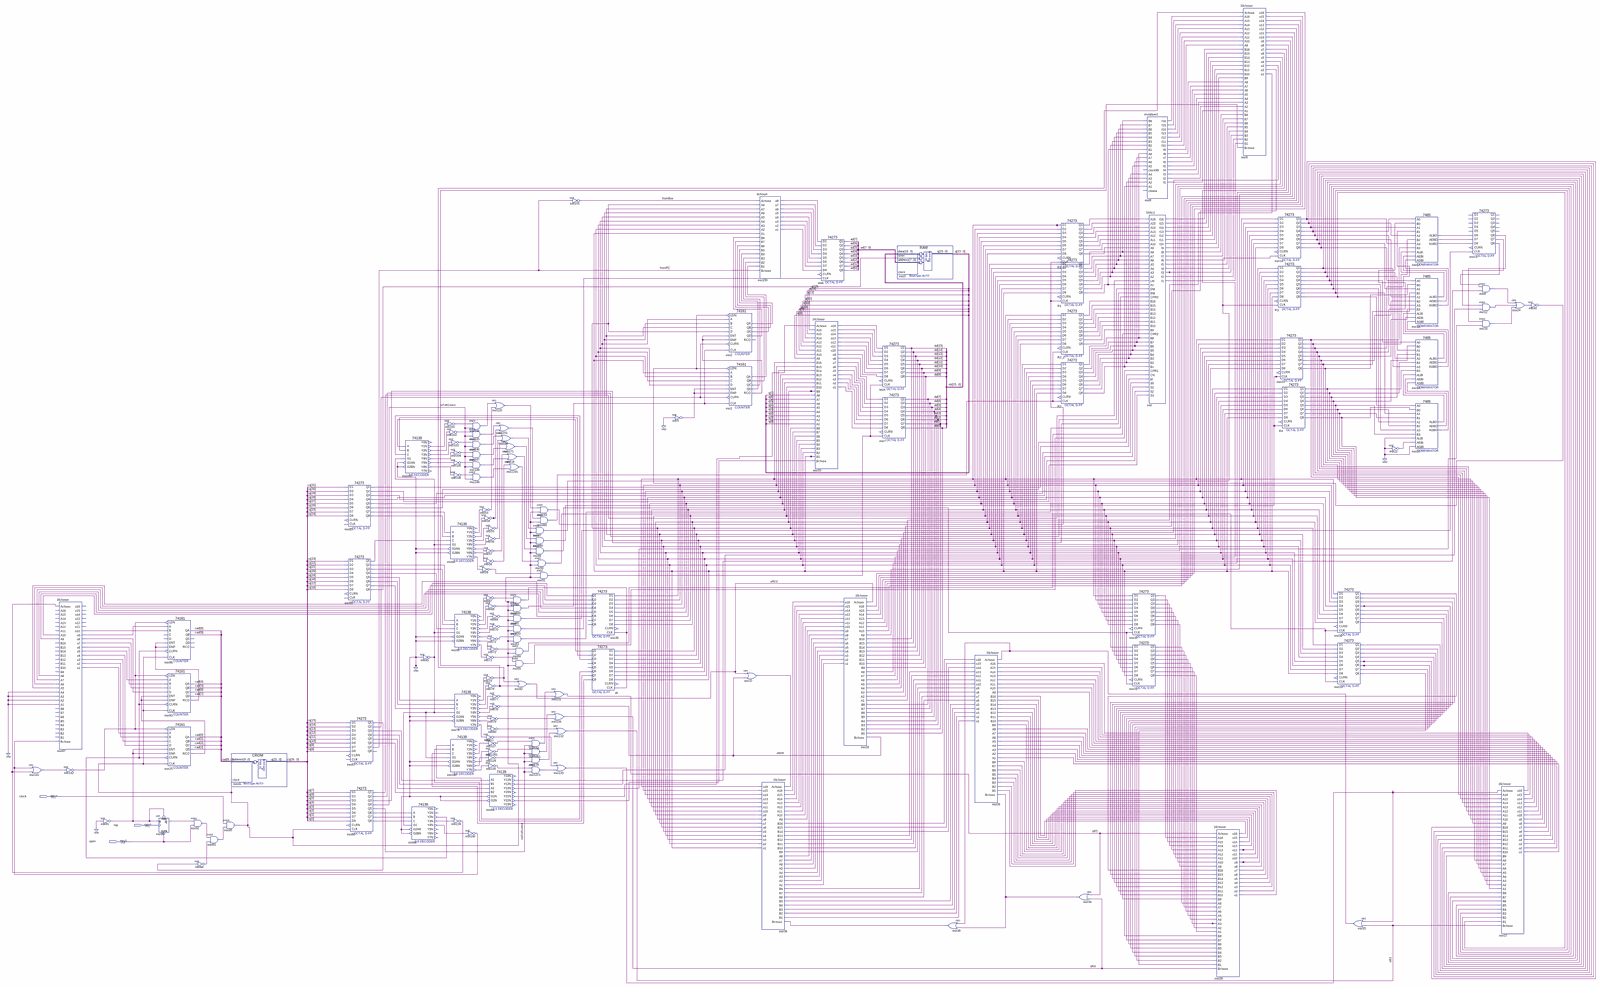
[diagram p0: schematic sheet, whole]
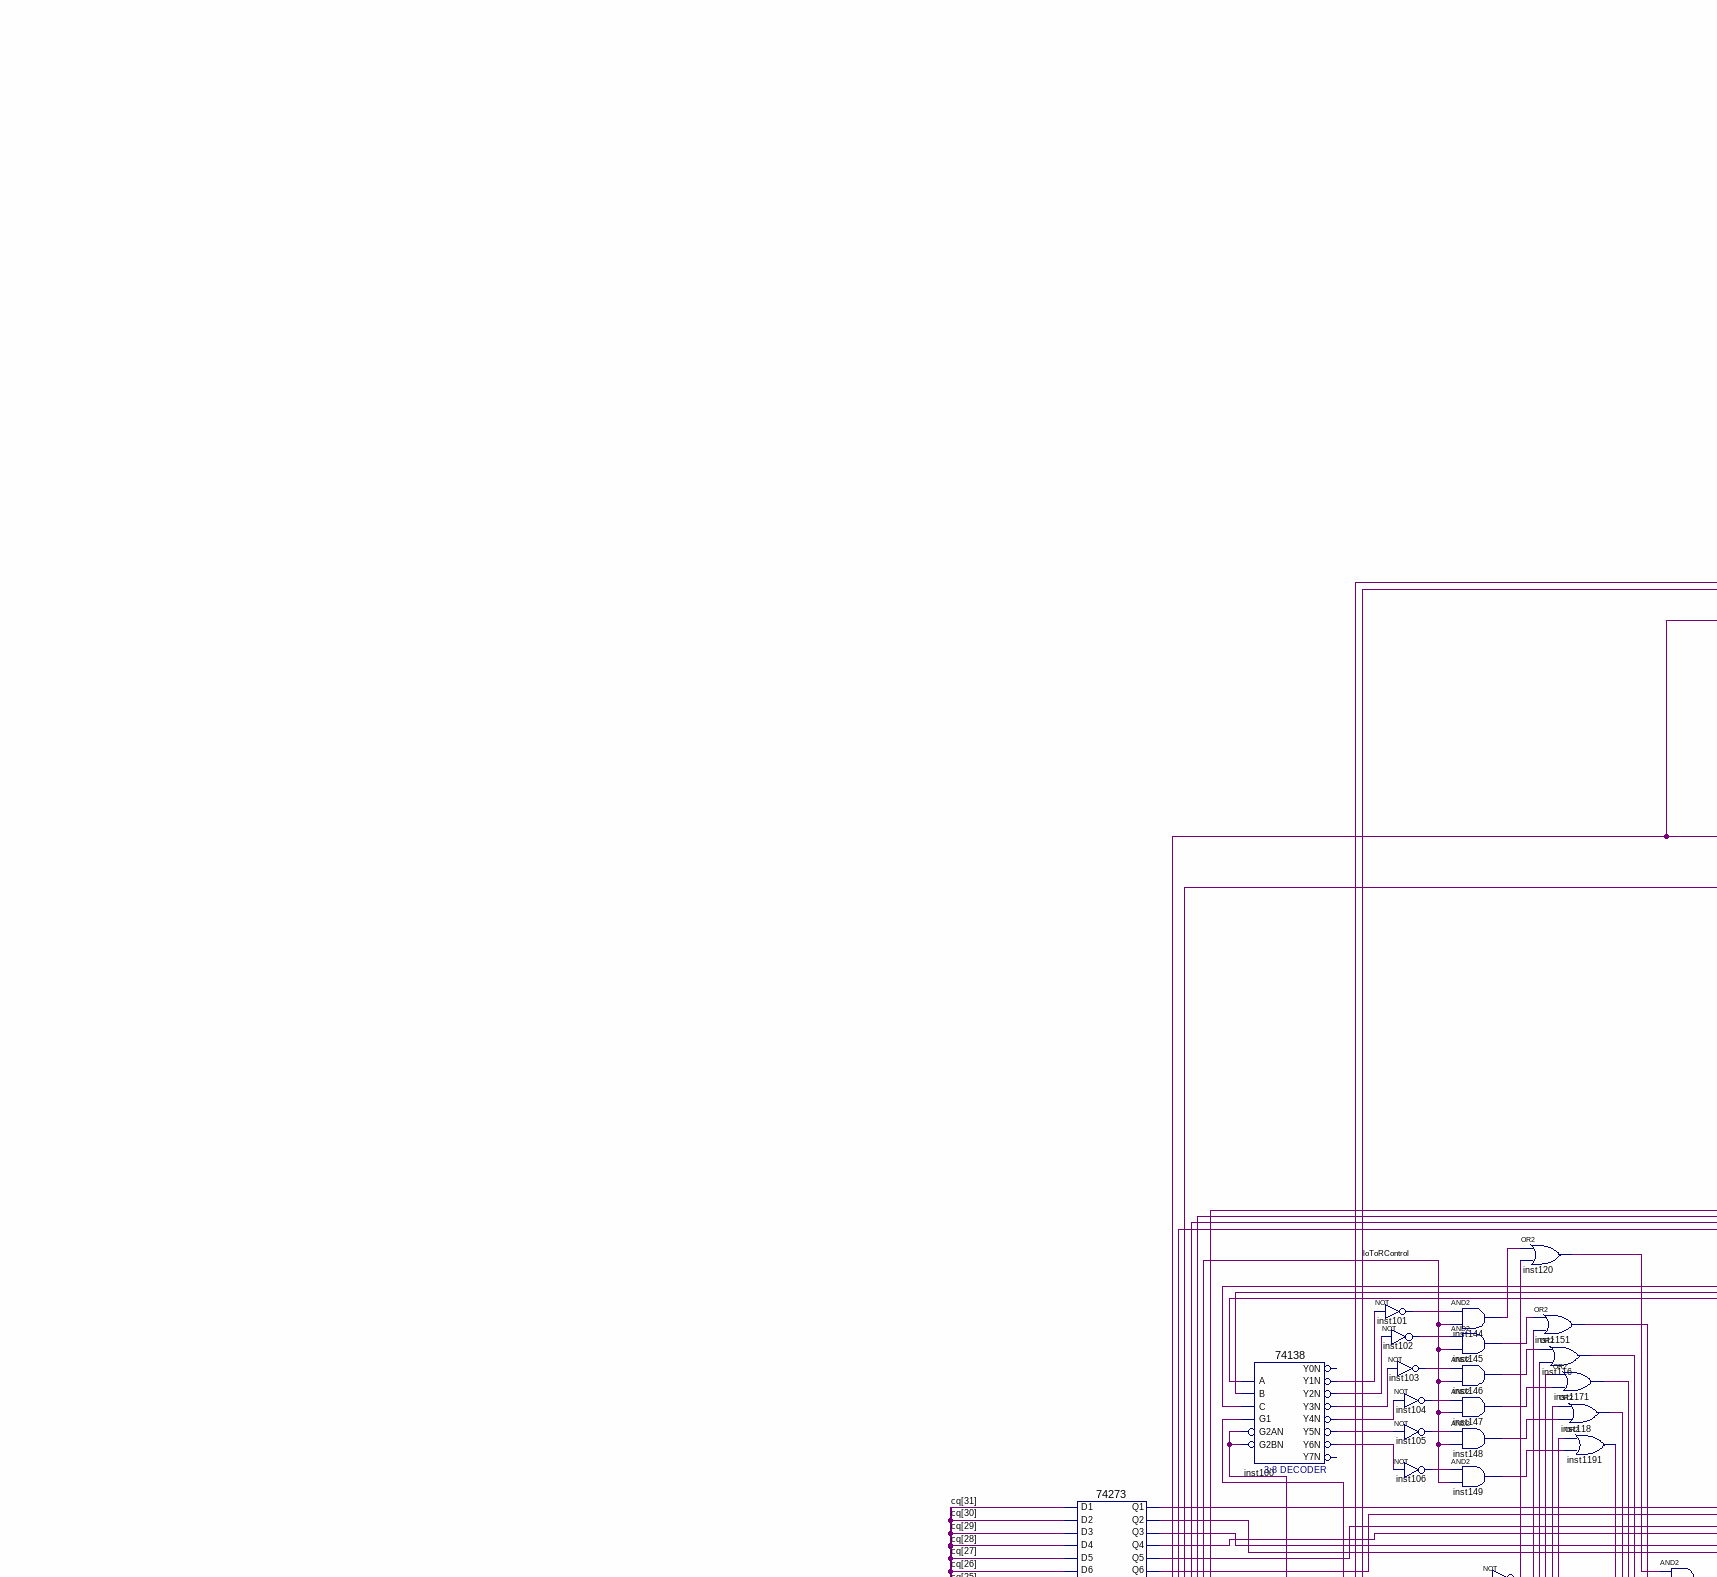
[diagram p1: schematic sheet, upper left part]
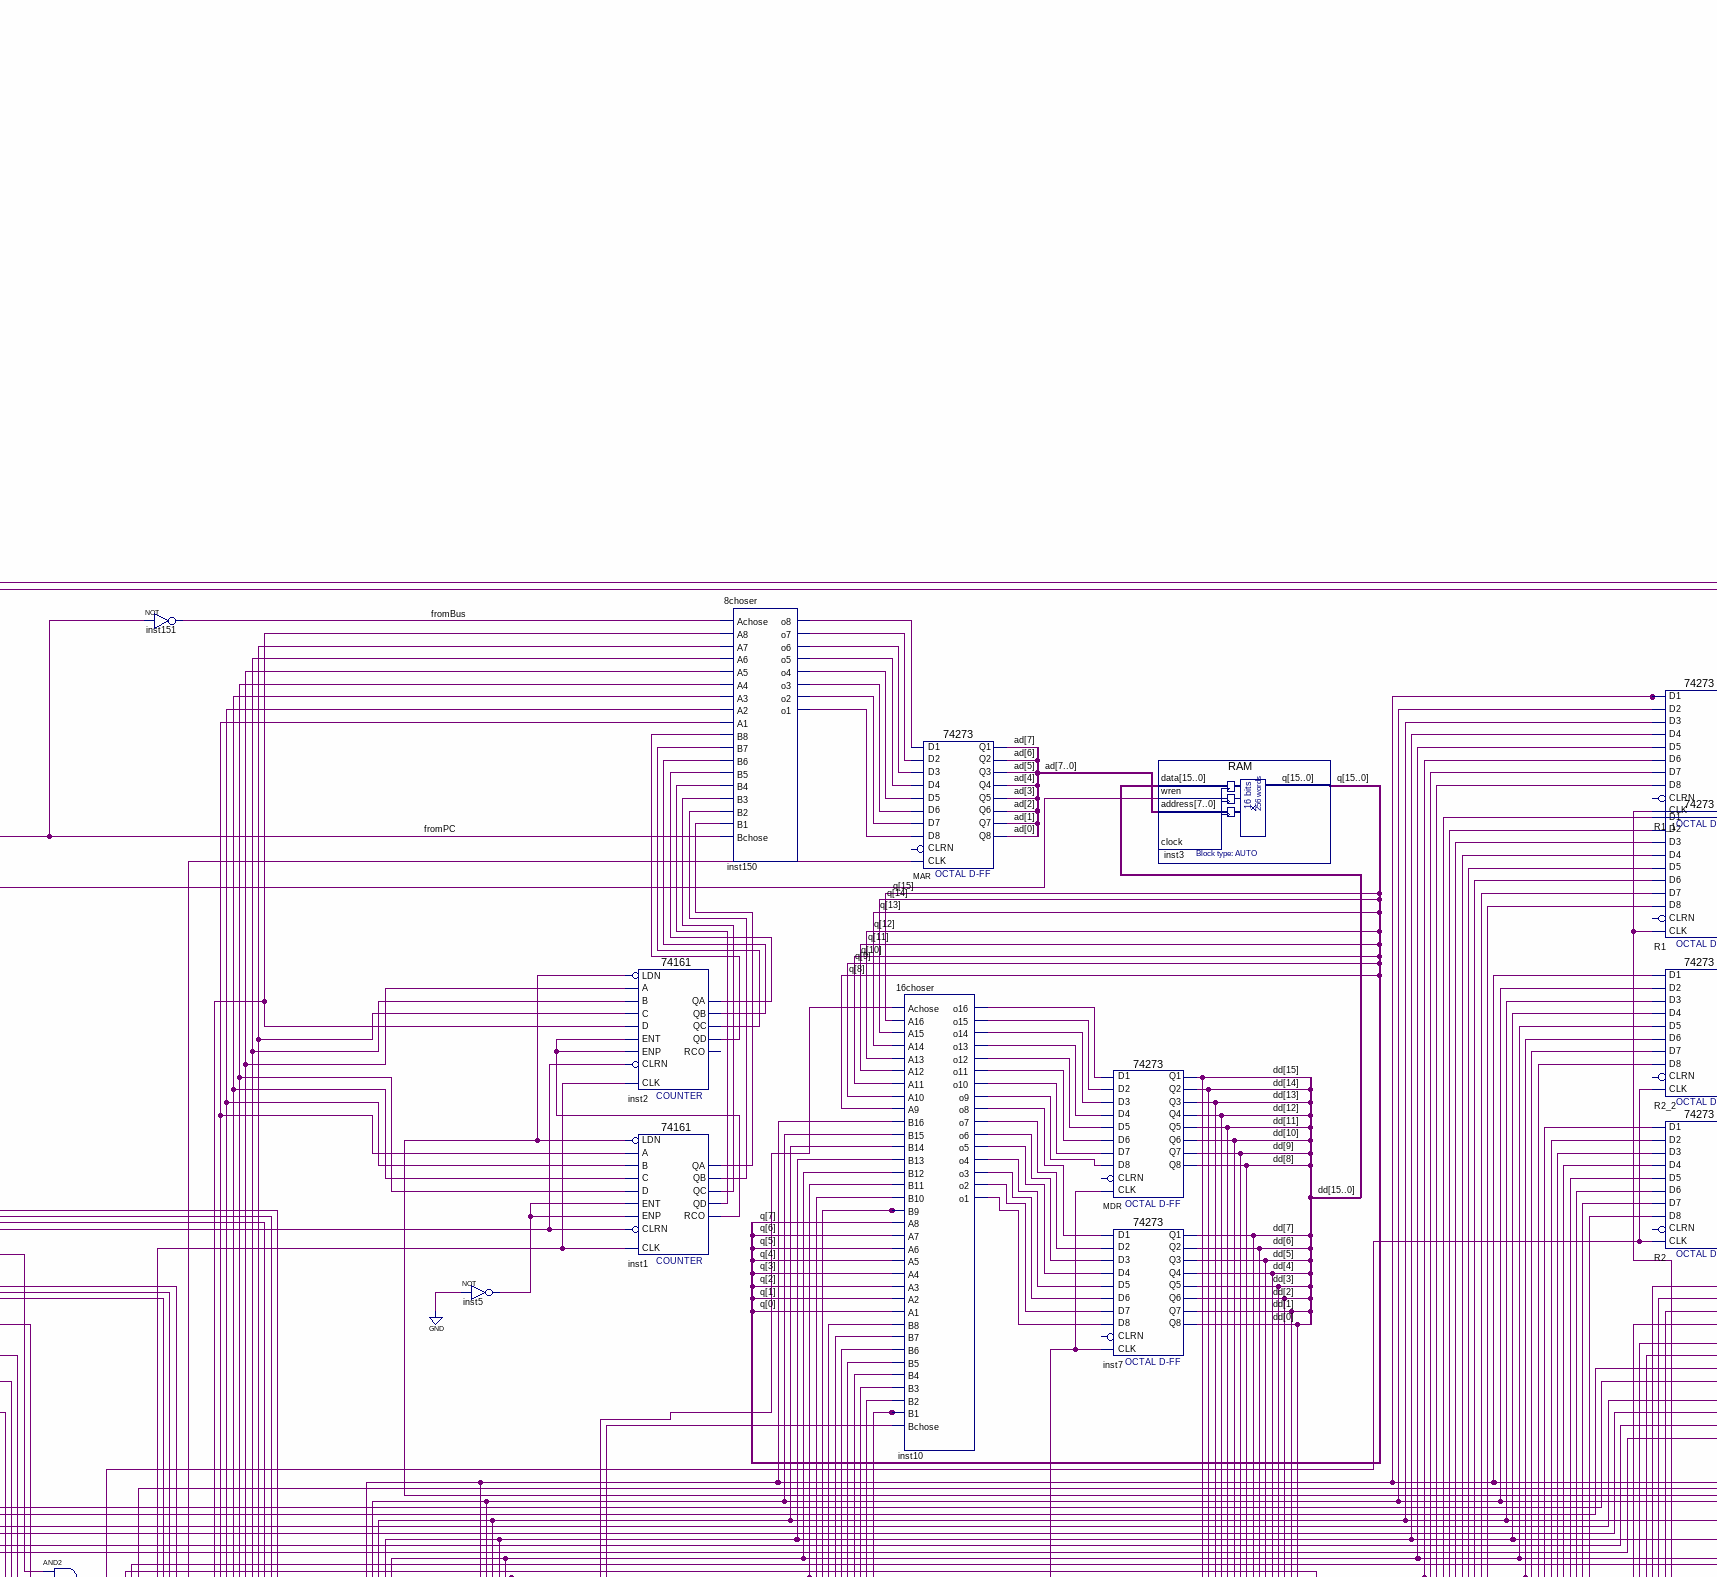
[diagram p2: schematic sheet, upper centre part]
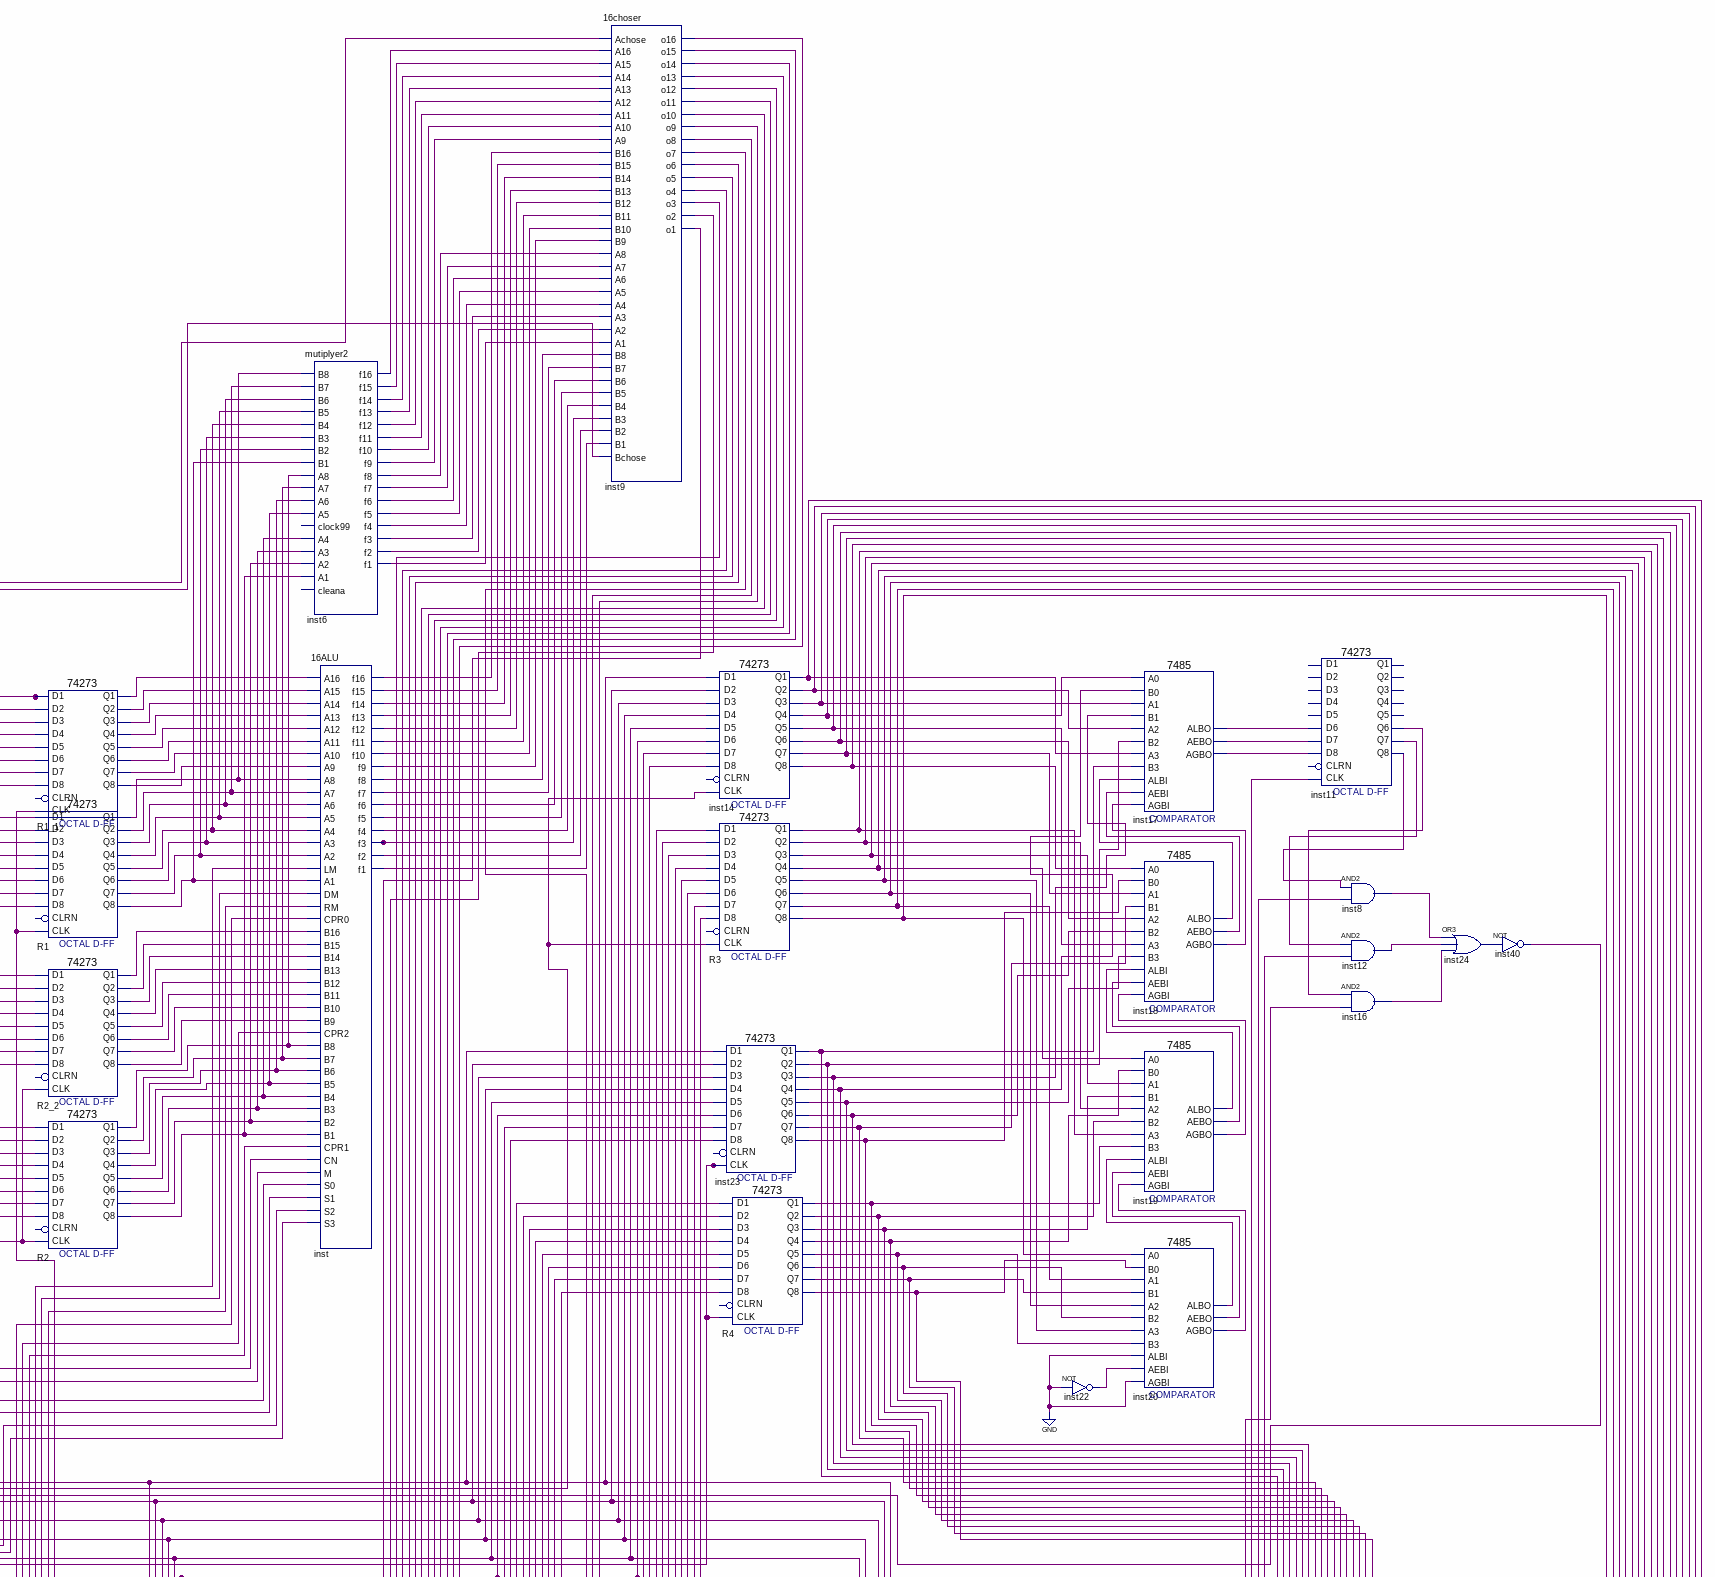
[diagram p3: schematic sheet, upper right part]
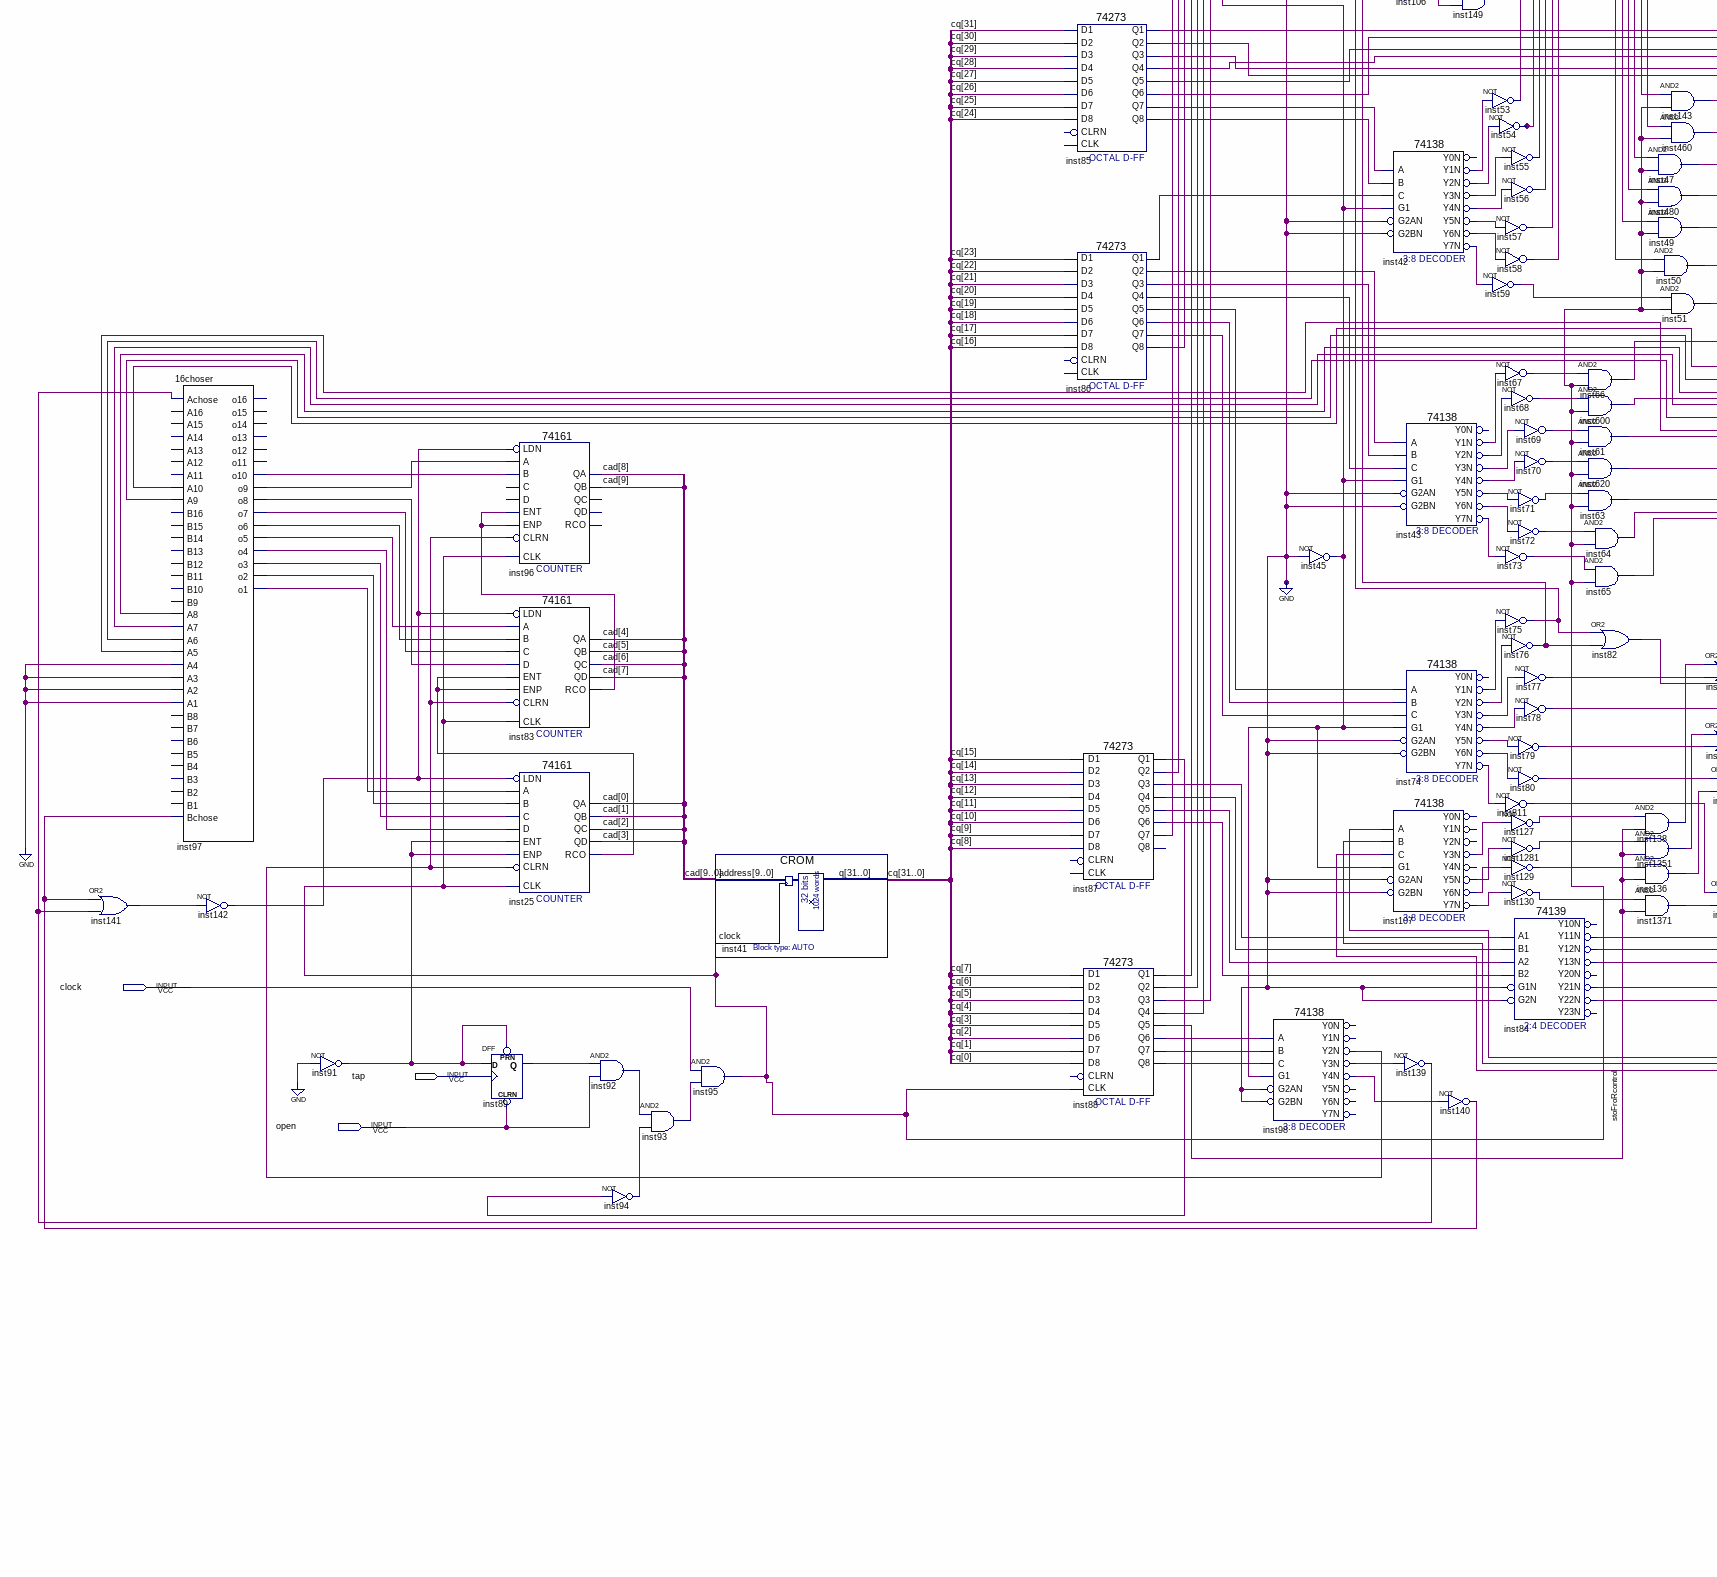
[diagram p4: schematic sheet, lower left part]
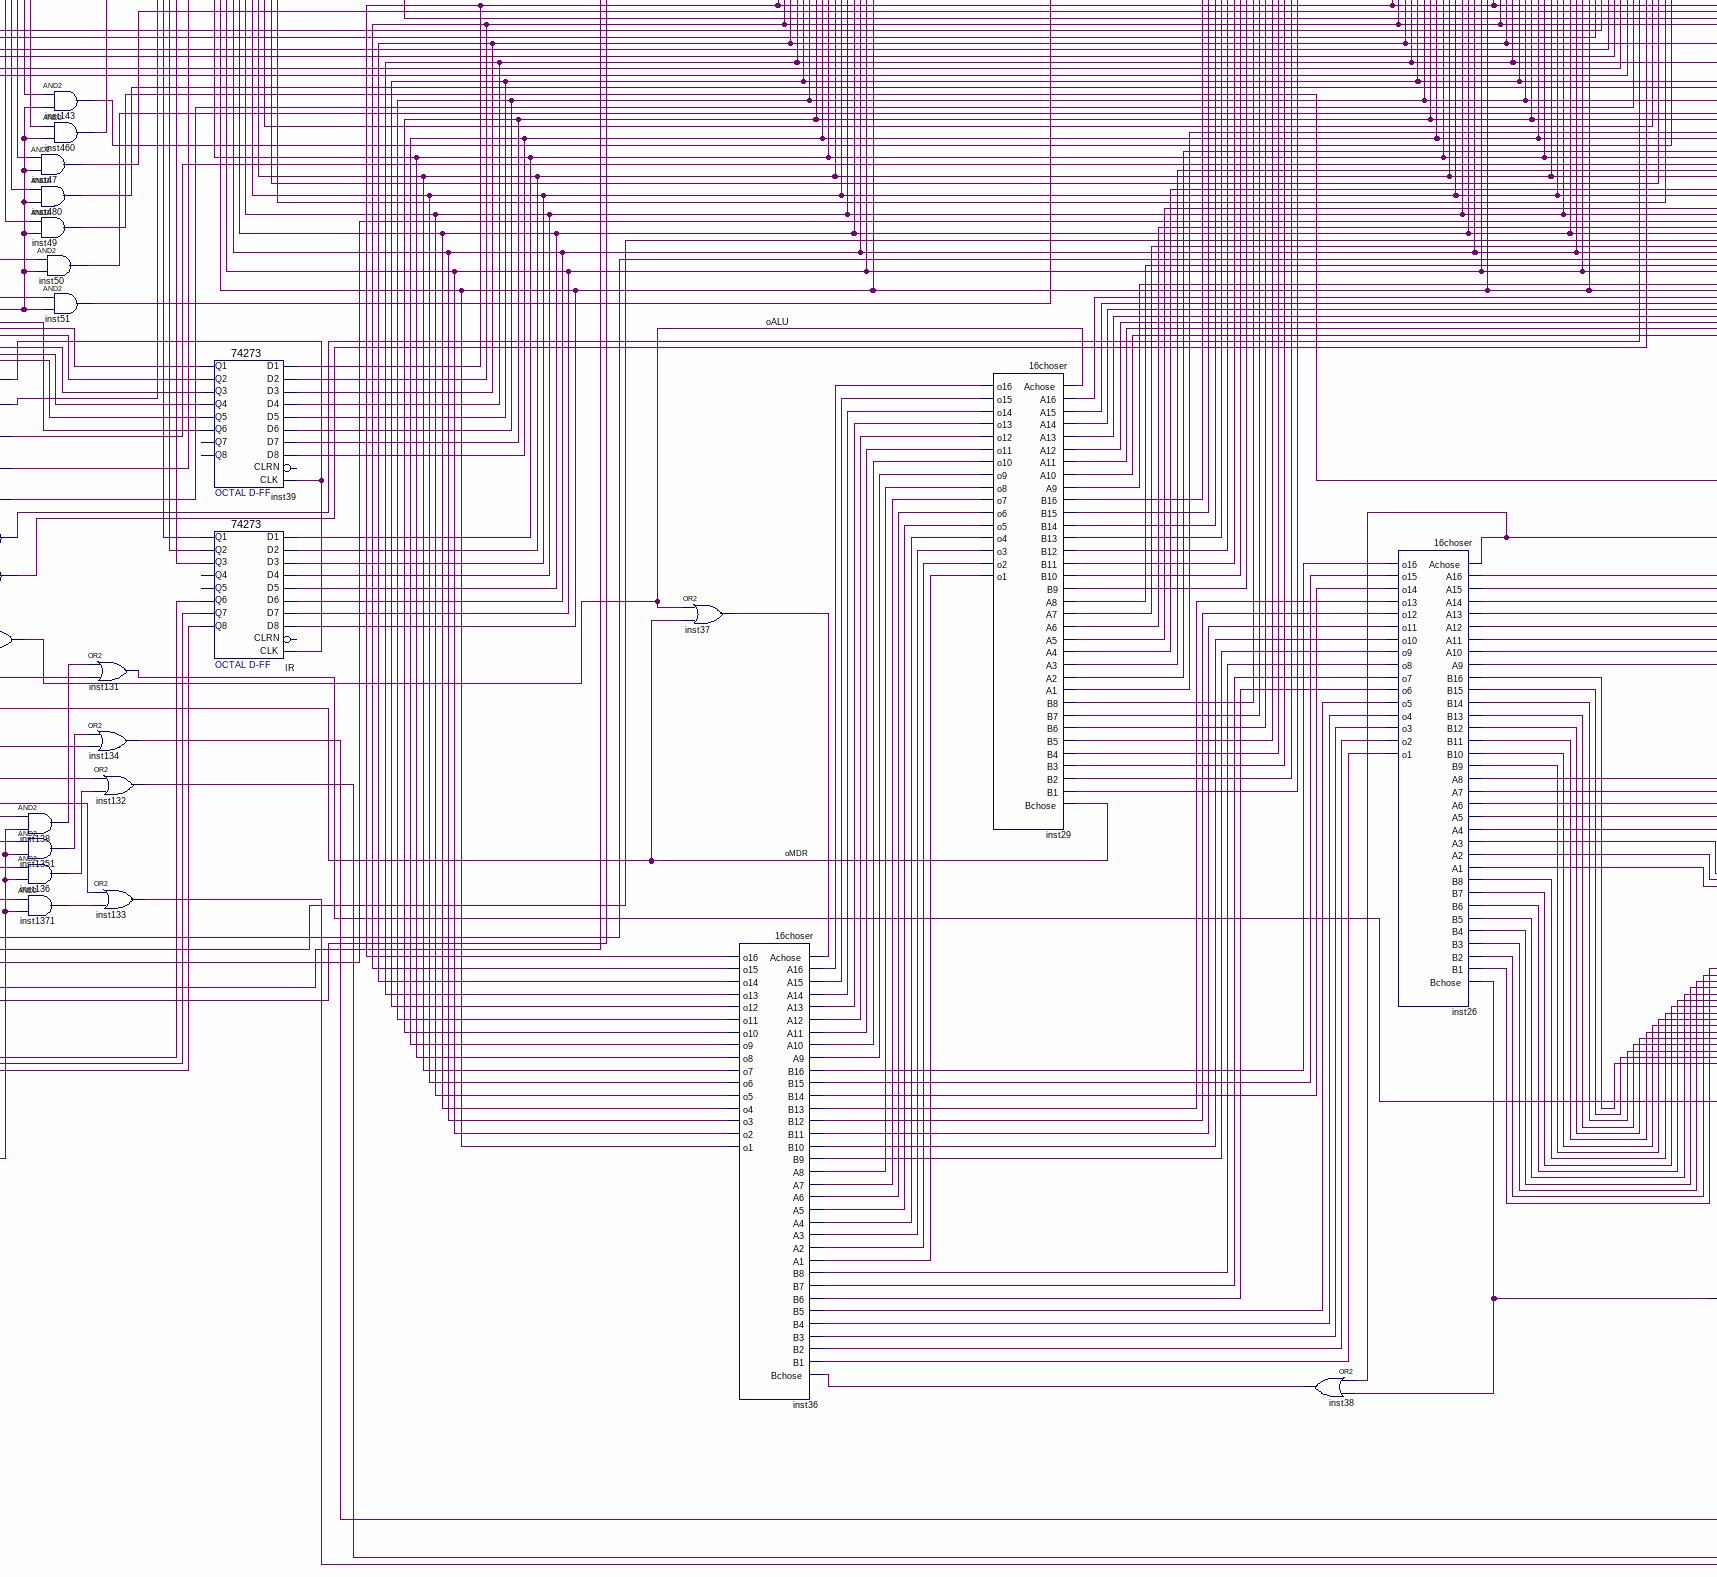
[diagram p5: schematic sheet, lower centre part]
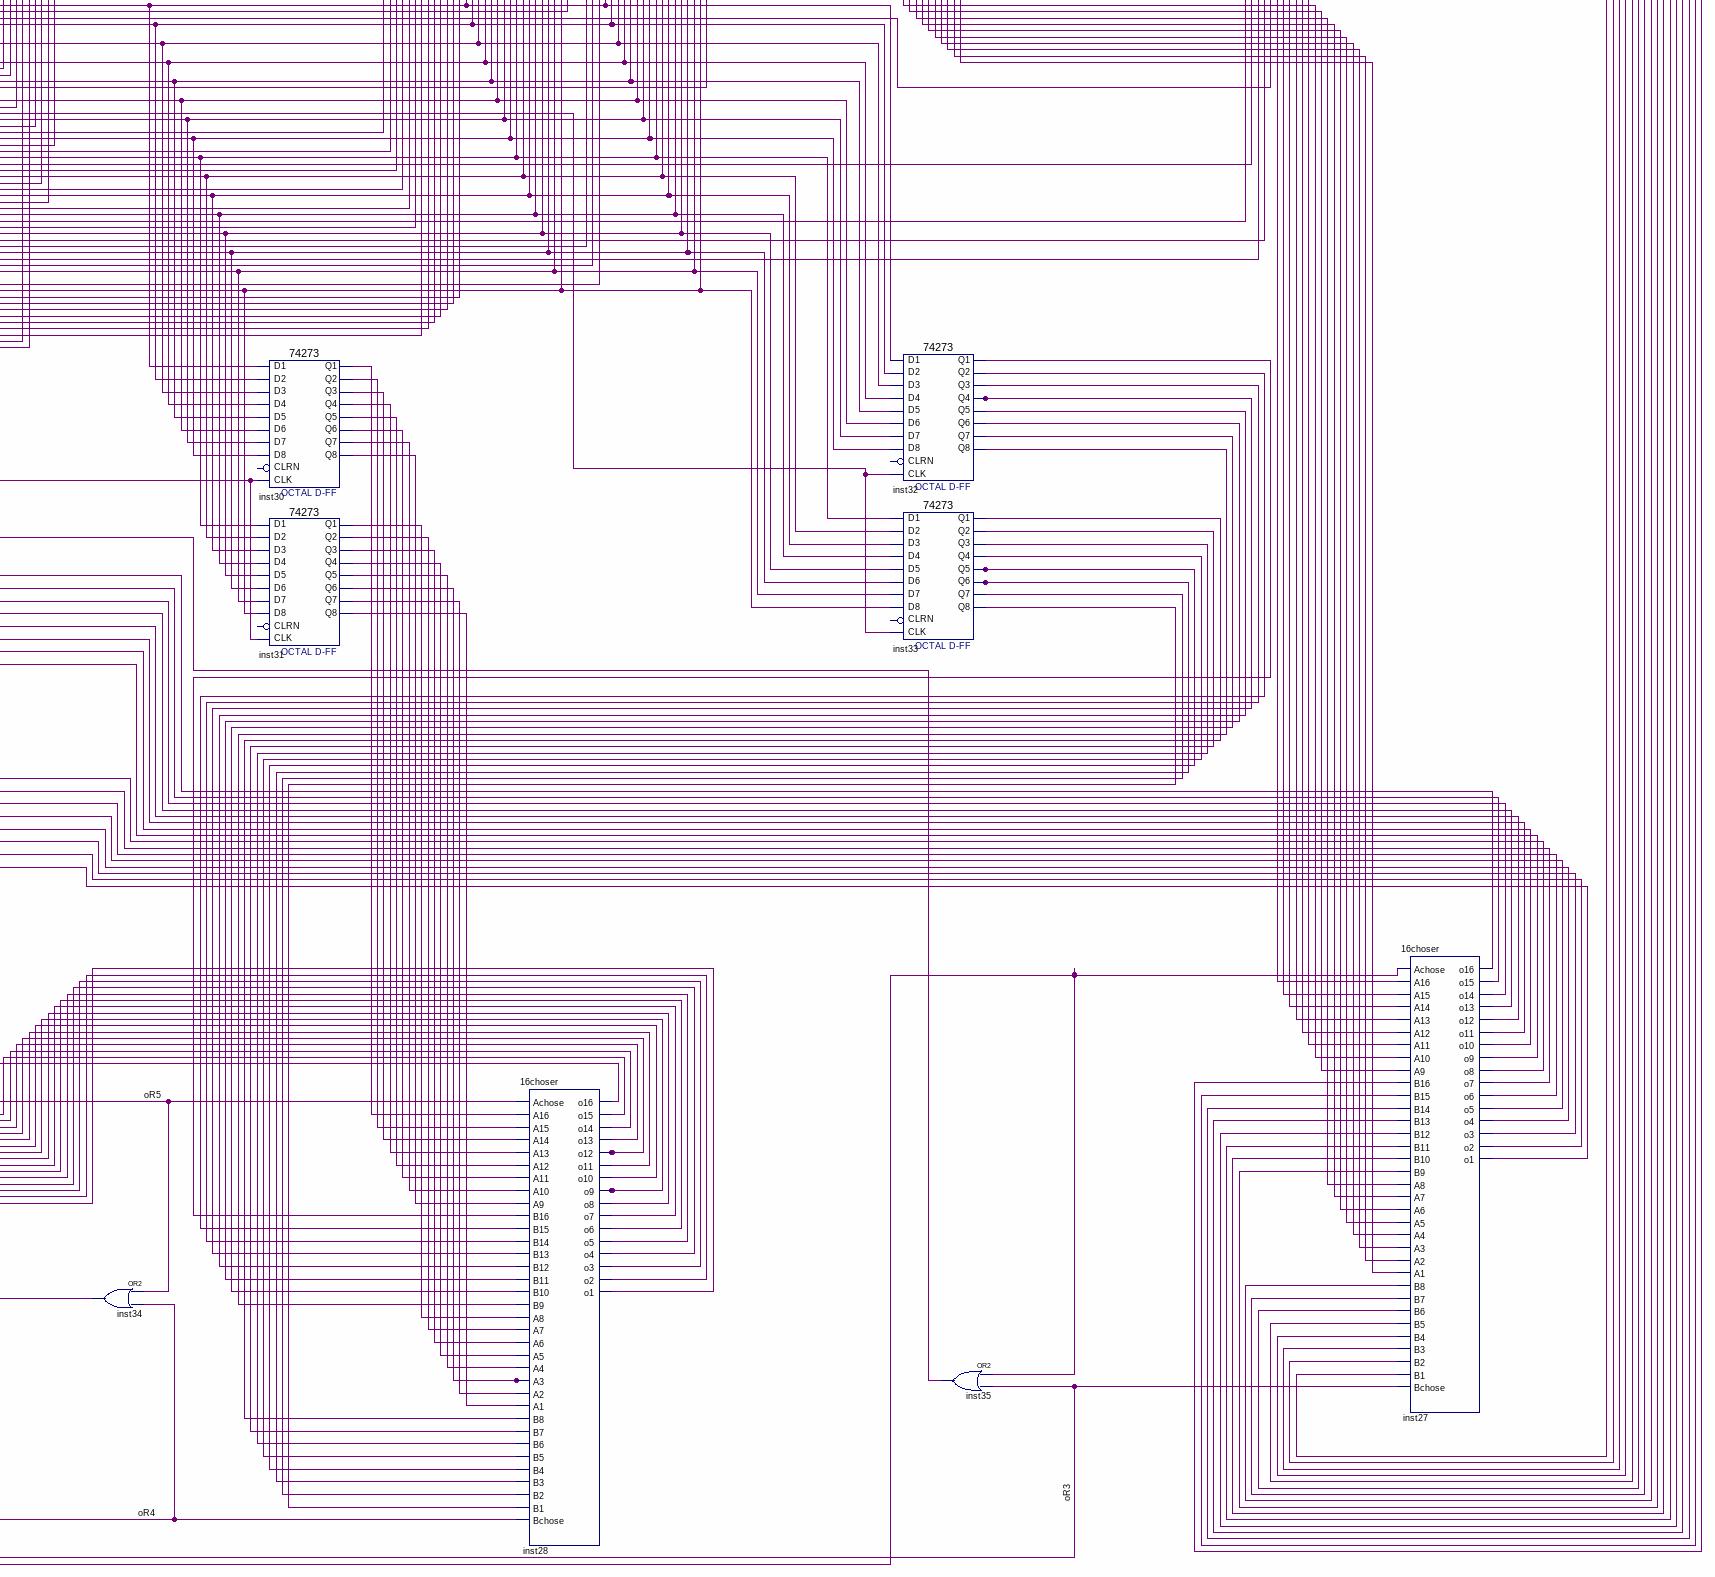
[diagram p6: schematic sheet, lower right part]
// Quartus schematic p2ro3.bdf as structural Verilog: 140 symbols, 3 pins
module p2ro3 (
  input  clock,
  input  tap,
  input  open
);

  wire fromBus, fromPC, inst1_qa, inst1_qb, inst1_qc, inst1_qd, inst1_rco, inst2_qa, inst2_qb, inst2_qc,
       inst2_qd, inst5_out, inst6_f1, inst6_f2, inst6_f3, inst6_f4, inst6_f5, inst6_f6, inst6_f7, inst6_f8,
       inst6_f9, inst6_f10, inst6_f11, inst6_f12, inst6_f13, inst6_f14, inst6_f15, inst6_f16, inst8_out,
       inst9_o1, inst9_o2, inst9_o3, inst9_o4, inst9_o5, inst9_o6, inst9_o7, inst9_o8, inst9_o9, inst9_o10,
       inst9_o11, inst9_o12, inst9_o13, inst9_o14, inst9_o15, inst9_o16, inst10_o1, inst10_o2, inst10_o3,
       inst10_o4, inst10_o5, inst10_o6, inst10_o7, inst10_o8, inst10_o9, inst10_o10, inst10_o11, inst10_o12,
       inst10_o13, inst10_o14, inst10_o15, inst10_o16, inst11_q6, inst11_q7, inst11_q8, inst12_out,
       inst14_q1, inst14_q2, inst14_q3, inst14_q4, inst14_q5, inst14_q6, inst14_q7, inst14_q8, inst16_out,
       inst17_aebo, inst17_agbo, inst17_albo, inst18_aebo, inst18_agbo, inst18_albo, inst19_aebo,
       inst19_agbo, inst19_albo, inst20_aebo, inst20_agbo, inst20_albo, inst22_out, inst23_q1, inst23_q2,
       inst23_q3, inst23_q4, inst23_q5, inst23_q6, inst23_q7, inst23_q8, inst24_out, inst25_rco, inst26_o1,
       inst26_o2, inst26_o3, inst26_o4, inst26_o5, inst26_o6, inst26_o7, inst26_o8, inst26_o9, inst26_o10,
       inst26_o11, inst26_o12, inst26_o13, inst26_o14, inst26_o15, inst26_o16, inst27_o1, inst27_o2,
       inst27_o3, inst27_o4, inst27_o5, inst27_o6, inst27_o7, inst27_o8, inst27_o9, inst27_o10, inst27_o11,
       inst27_o12, inst27_o13, inst27_o14, inst27_o15, inst27_o16, inst28_o1, inst28_o2, inst28_o3,
       inst28_o4, inst28_o5, inst28_o6, inst28_o7, inst28_o8, inst28_o9, inst28_o10, inst28_o11, inst28_o12,
       inst28_o13, inst28_o14, inst28_o15, inst28_o16, inst29_o1, inst29_o2, inst29_o3, inst29_o4, inst29_o5,
       inst29_o6, inst29_o7, inst29_o8, inst29_o9, inst29_o10, inst29_o11, inst29_o12, inst29_o13,
       inst29_o14, inst29_o15, inst29_o16, inst30_q1, inst30_q2, inst30_q3, inst30_q4, inst30_q5, inst30_q6,
       inst30_q7, inst30_q8, inst31_q1, inst31_q2, inst31_q3, inst31_q4, inst31_q5, inst31_q6, inst31_q7,
       inst31_q8, inst32_q1, inst32_q2, inst32_q3, inst32_q4, inst32_q5, inst32_q6, inst32_q7, inst32_q8,
       inst33_q1, inst33_q2, inst33_q3, inst33_q4, inst33_q5, inst33_q6, inst33_q7, inst33_q8, inst34_out,
       inst35_out, inst36_o1, inst36_o2, inst36_o3, inst36_o4, inst36_o5, inst36_o6, inst36_o7, inst36_o8,
       inst36_o9, inst36_o10, inst36_o11, inst36_o12, inst36_o13, inst36_o14, inst36_o15, inst36_o16,
       inst37_out, inst38_out, inst39_q1, inst39_q2, inst39_q3, inst39_q4, inst39_q5, inst39_q6, inst40_out,
       inst42_y1n, inst42_y2n, inst42_y3n, inst42_y4n, inst42_y5n, inst42_y6n, inst42_y7n, inst43_y1n,
       inst43_y2n, inst43_y3n, inst43_y4n, inst43_y5n, inst43_y6n, inst43_y7n, inst45_out, inst47_out,
       inst49_out, inst50_out, inst51_out, inst53_out, inst54_out, inst55_out, inst56_out, inst57_out,
       inst58_out, inst59_out, inst61_out, inst63_out, inst64_out, inst65_out, inst66_out, inst67_out,
       inst68_out, inst69_out, inst70_out, inst71_out, inst72_out, inst73_out, inst74_y1n, inst74_y2n,
       inst74_y3n, inst74_y4n, inst74_y5n, inst74_y6n, inst74_y7n, inst75_out, inst76_out, inst77_out,
       inst79_out, inst80_out, inst83_rco, inst84_y11n, inst84_y12n, inst84_y13n, inst84_y21n, inst84_y22n,
       inst85_q1, inst85_q2, inst85_q3, inst85_q4, inst85_q5, inst85_q6, inst85_q7, inst85_q8, inst86_q1,
       inst86_q2, inst86_q3, inst86_q4, inst86_q5, inst86_q6, inst86_q7, inst86_q8, inst87_q1, inst87_q2,
       inst87_q3, inst87_q4, inst87_q5, inst87_q6, inst88_q1, inst88_q2, inst88_q3, inst88_q6, inst88_q7,
       inst88_q8, inst89_q, inst91_out, inst92_out, inst93_out, inst94_out, inst95_out, inst97_o1, inst97_o2,
       inst97_o3, inst97_o4, inst97_o5, inst97_o6, inst97_o7, inst97_o8, inst97_o9, inst97_o10, inst98_y2n,
       inst98_y3n, inst98_y4n, inst100_y1n, inst100_y2n, inst100_y3n, inst100_y4n, inst100_y5n, inst100_y6n,
       inst101_out, inst102_out, inst103_out, inst104_out, inst105_out, inst106_out, inst107_y3n,
       inst107_y5n, inst107_y6n, inst107_y7n, inst116_out, inst118_out, inst120_out, inst127_out,
       inst129_out, inst130_out, inst133_out, inst136_out, inst138_out, inst139_out, inst140_out,
       inst141_out, inst142_out, inst143_out, inst144_out, inst145_out, inst146_out, inst147_out,
       inst148_out, inst149_out, inst150_o1, inst150_o2, inst150_o3, inst150_o4, inst150_o5, inst150_o6,
       inst150_o7, inst150_o8, inst460_out, inst480_out, inst600_out, inst620_out, inst811_out, inst1151_out,
       inst1171_out, inst1191_out, inst1281_out, inst1351_out, inst1371_out, inst_f1, inst_f2, inst_f3,
       inst_f4, inst_f5, inst_f6, inst_f7, inst_f8, inst_f9, inst_f10, inst_f11, inst_f12, inst_f13,
       inst_f14, inst_f15, inst_f16, IR_q1, IR_q2, IR_q3, IR_q6, IR_q7, IR_q8, loToRControl, oALU, oMDR, oR3,
       oR4, oR5, R1_1_q1, R1_1_q2, R1_1_q3, R1_1_q4, R1_1_q5, R1_1_q6, R1_1_q7, R1_1_q8, R1_q1, R1_q2, R1_q3,
       R1_q4, R1_q5, R1_q6, R1_q7, R1_q8, R2_2_q1, R2_2_q2, R2_2_q3, R2_2_q4, R2_2_q5, R2_2_q6, R2_2_q7,
       R2_2_q8, R2_q1, R2_q2, R2_q3, R2_q4, R2_q5, R2_q6, R2_q7, R2_q8, R3_q1, R3_q2, R3_q3, R3_q4, R3_q5,
       R3_q6, R3_q7, R3_q8, R4_q1, R4_q2, R4_q3, R4_q4, R4_q5, R4_q6, R4_q7, R4_q8, stoFroRcontrol;
  wire [7:0] ad;
  wire [9:0] cad;
  wire [15:0] dd, q;
  wire [31:0] cq;

  or inst141 (inst141_out, inst140_out, inst139_out);
  \16choser  inst97 (
    .Achose(inst139_out), .A10(inst39_q1), .A9(inst39_q2), .A8(inst39_q3), .A7(inst39_q4), .A6(inst39_q5),
    .A5(inst39_q6), .A4(1'b0), .A3(1'b0), .A2(1'b0), .A1(1'b0), .Bchose(inst140_out), .o10(inst97_o10),
    .o9(inst97_o9), .o8(inst97_o8), .o7(inst97_o7), .o6(inst97_o6), .o5(inst97_o5), .o4(inst97_o4),
    .o3(inst97_o3), .o2(inst97_o2), .o1(inst97_o1));  // open: A16, A15, A14, A13, A12, A11, B16, B15, B14, B13, B12, B11, B10, B9, B8, B7, B6, B5, B4, B3, B2, B1, o16, o15, o14, o13, o12, o11
  not inst142 (inst142_out, inst141_out);
  not inst91 (inst91_out, 1'b0);
  \74161  inst96 (
    .CLRN(inst98_y2n), .CLK(inst95_out), .ENP(inst83_rco), .LDN(inst142_out), .A(inst97_o9),
    .ENT(inst83_rco), .B(inst97_o10), .QB(cad[9]), .QA(cad[8]));  // open: D, C, QD, QC, RCO
  \74161  inst83 (
    .CLRN(inst98_y2n), .CLK(inst95_out), .ENP(inst25_rco), .LDN(inst142_out), .A(inst97_o5), .D(inst97_o8),
    .ENT(inst25_rco), .B(inst97_o6), .C(inst97_o7), .QD(cad[7]), .QC(cad[6]), .QB(cad[5]), .QA(cad[4]),
    .RCO(inst83_rco));
  \74161  inst25 (
    .CLRN(inst98_y2n), .CLK(inst95_out), .ENP(inst91_out), .LDN(inst142_out), .A(inst97_o1), .D(inst97_o4),
    .ENT(inst91_out), .B(inst97_o2), .C(inst97_o3), .QD(cad[3]), .QC(cad[2]), .QB(cad[1]), .QA(cad[0]),
    .RCO(inst25_rco));
  DFF inst89 (.CLRN(open), .CLK(tap), .D(inst91_out), .PRN(inst91_out), .Q(inst89_q));
  and inst92 (inst92_out, inst89_q, open);
  not inst94 (inst94_out, inst87_q1);
  and inst93 (inst93_out, inst92_out, inst94_out);
  CROM inst41 (.address(cad), .clock(inst95_out), .q(cq));
  and inst95 (inst95_out, clock, inst93_out);
  \74273  inst85 (
    .D2(cq[30]), .D3(cq[29]), .D1(cq[31]), .D4(cq[28]), .D7(cq[25]), .D6(cq[26]), .D5(cq[27]), .D8(cq[24]),
    .Q4(inst85_q4), .Q1(inst85_q1), .Q2(inst85_q2), .Q3(inst85_q3), .Q6(inst85_q6), .Q5(inst85_q5),
    .Q7(inst85_q7), .Q8(inst85_q8));  // open: CLK, CLRN
  \74273  inst86 (
    .D2(cq[22]), .D3(cq[21]), .D1(cq[23]), .D4(cq[20]), .D7(cq[17]), .D6(cq[18]), .D5(cq[19]), .D8(cq[16]),
    .Q4(inst86_q4), .Q1(inst86_q1), .Q2(inst86_q2), .Q3(inst86_q3), .Q6(inst86_q6), .Q5(inst86_q5),
    .Q7(inst86_q7), .Q8(inst86_q8));  // open: CLK, CLRN
  \74273  inst87 (
    .D2(cq[14]), .D3(cq[13]), .D1(cq[15]), .D4(cq[12]), .D7(cq[9]), .D6(cq[10]), .D5(cq[11]), .D8(cq[8]),
    .Q4(inst87_q4), .Q1(inst87_q1), .Q2(inst87_q2), .Q3(inst87_q3), .Q6(inst87_q6), .Q5(inst87_q5),
    .Q7(fromPC));  // open: CLK, CLRN, Q8
  \74273  inst88 (
    .D2(cq[6]), .D3(cq[5]), .D1(cq[7]), .D4(cq[4]), .D7(cq[1]), .D6(cq[2]), .D5(cq[3]), .D8(cq[0]),
    .CLK(inst95_out), .Q4(loToRControl), .Q1(inst88_q1), .Q2(inst88_q2), .Q3(inst88_q3), .Q6(inst88_q6),
    .Q5(stoFroRcontrol), .Q7(inst88_q7), .Q8(inst88_q8));  // open: CLRN
  \74138  inst100 (
    .A(IR_q1), .B(IR_q2), .G1(inst45_out), .C(IR_q3), .G2AN(1'b0), .G2BN(1'b0), .Y1N(inst100_y1n),
    .Y2N(inst100_y2n), .Y3N(inst100_y3n), .Y4N(inst100_y4n), .Y5N(inst100_y5n), .Y6N(inst100_y6n));  // open: Y0N, Y7N
  \74138  inst98 (
    .A(inst88_q6), .B(inst88_q7), .G1(inst45_out), .C(inst88_q8), .G2AN(1'b0), .G2BN(1'b0), .Y2N(inst98_y2n),
    .Y3N(inst98_y3n), .Y4N(inst98_y4n));  // open: Y0N, Y1N, Y5N, Y6N, Y7N
  not inst45 (inst45_out, 1'b0);
  not inst101 (inst101_out, inst100_y1n);
  not inst102 (inst102_out, inst100_y2n);
  not inst103 (inst103_out, inst100_y3n);
  \74138  inst42 (
    .A(inst85_q7), .B(inst85_q8), .G1(inst45_out), .C(inst86_q1), .G2AN(1'b0), .G2BN(1'b0), .Y1N(inst42_y1n),
    .Y2N(inst42_y2n), .Y3N(inst42_y3n), .Y4N(inst42_y4n), .Y5N(inst42_y5n), .Y6N(inst42_y6n), .Y7N(inst42_y7n));  // open: Y0N
  \74138  inst107 (
    .A(IR_q6), .B(IR_q7), .G1(inst45_out), .C(IR_q8), .G2AN(1'b0), .G2BN(1'b0), .Y3N(inst107_y3n),
    .Y5N(inst107_y5n), .Y6N(inst107_y6n), .Y7N(inst107_y7n));  // open: Y0N, Y1N, Y2N, Y4N
  not inst104 (inst104_out, inst100_y4n);
  not inst105 (inst105_out, inst100_y5n);
  not inst106 (inst106_out, inst100_y6n);
  \74138  inst43 (
    .A(inst86_q2), .B(inst86_q3), .G1(inst45_out), .C(inst86_q4), .G2AN(1'b0), .G2BN(1'b0), .Y1N(inst43_y1n),
    .Y2N(inst43_y2n), .Y3N(inst43_y3n), .Y4N(inst43_y4n), .Y5N(inst43_y5n), .Y6N(inst43_y6n), .Y7N(inst43_y7n));  // open: Y0N
  \74138  inst74 (
    .A(inst86_q5), .B(inst86_q6), .G1(inst45_out), .C(inst86_q7), .G2AN(1'b0), .G2BN(1'b0), .Y1N(inst74_y1n),
    .Y2N(inst74_y2n), .Y3N(inst74_y3n), .Y4N(inst74_y4n), .Y5N(inst74_y5n), .Y6N(inst74_y6n), .Y7N(inst74_y7n));  // open: Y0N
  not inst139 (inst139_out, inst98_y3n);
  not inst140 (inst140_out, inst98_y4n);
  and inst144 (inst144_out, inst101_out, loToRControl);
  and inst145 (inst145_out, inst102_out, loToRControl);
  and inst146 (inst146_out, inst103_out, loToRControl);
  and inst147 (inst147_out, inst104_out, loToRControl);
  and inst148 (inst148_out, inst105_out, loToRControl);
  and inst149 (inst149_out, inst106_out, loToRControl);
  not inst53 (inst53_out, inst42_y1n);
  not inst54 (inst54_out, inst42_y2n);
  not inst59 (inst59_out, inst42_y7n);
  or inst120 (inst120_out, inst144_out, inst53_out);
  or inst1151 (inst1151_out, inst145_out, inst54_out);
  or inst116 (inst116_out, inst146_out, inst55_out);
  not inst55 (inst55_out, inst42_y3n);
  not inst56 (inst56_out, inst42_y4n);
  not inst57 (inst57_out, inst42_y5n);
  not inst58 (inst58_out, inst42_y6n);
  not inst67 (inst67_out, inst43_y1n);
  not inst68 (inst68_out, inst43_y2n);
  not inst69 (inst69_out, inst43_y3n);
  not inst70 (inst70_out, inst43_y4n);
  not inst71 (inst71_out, inst43_y5n);
  not inst72 (inst72_out, inst43_y6n);
  not inst73 (inst73_out, inst43_y7n);
  not inst75 (inst75_out, inst74_y1n);
  not inst76 (inst76_out, inst74_y2n);
  not inst77 (inst77_out, inst74_y3n);
  not inst78 (oMDR, inst74_y4n);
  not inst79 (inst79_out, inst74_y5n);
  not inst80 (inst80_out, inst74_y6n);
  not inst811 (inst811_out, inst74_y7n);
  not inst127 (inst127_out, inst107_y3n);
  not inst1281 (inst1281_out, inst107_y5n);
  not inst129 (inst129_out, inst107_y6n);
  not inst130 (inst130_out, inst107_y7n);
  \74139  inst84 (
    .A1(inst87_q3), .A2(inst87_q5), .B1(inst87_q4), .B2(inst87_q6), .G1N(1'b0), .G2N(1'b0),
    .Y13N(inst84_y13n), .Y12N(inst84_y12n), .Y11N(inst84_y11n), .Y21N(inst84_y21n), .Y22N(inst84_y22n));  // open: Y10N, Y20N, Y23N
  or inst1171 (inst1171_out, inst56_out, inst147_out);
  or inst118 (inst118_out, inst57_out, inst148_out);
  or inst1191 (inst1191_out, inst58_out, inst149_out);
  and inst66 (inst66_out, inst67_out, inst95_out);
  and inst600 (inst600_out, inst68_out, inst95_out);
  and inst61 (inst61_out, inst69_out, inst95_out);
  and inst620 (inst620_out, inst70_out, inst95_out);
  and inst63 (inst63_out, inst71_out, inst95_out);
  and inst64 (inst64_out, inst72_out, inst95_out);
  and inst65 (inst65_out, inst73_out, inst95_out);
  or inst82 (oALU, inst75_out, inst76_out);
  and inst138 (inst138_out, inst127_out, stoFroRcontrol);
  and inst1351 (inst1351_out, inst1281_out, stoFroRcontrol);
  and inst136 (inst136_out, inst129_out, stoFroRcontrol);
  and inst1371 (inst1371_out, inst130_out, stoFroRcontrol);
  and inst143 (inst143_out, inst120_out, inst95_out);
  and inst460 (inst460_out, inst1151_out, inst95_out);
  and inst47 (inst47_out, inst116_out, inst95_out);
  and inst480 (inst480_out, inst1171_out, inst95_out);
  and inst49 (inst49_out, inst118_out, inst95_out);
  and inst50 (inst50_out, inst1191_out, inst95_out);
  and inst51 (inst51_out, inst59_out, inst95_out);
  or inst131 (oR5, inst138_out, inst77_out);
  or inst134 (oR4, inst1351_out, inst79_out);
  or inst132 (oR3, inst80_out, inst136_out);
  or inst133 (inst133_out, inst811_out, inst1371_out);
  not inst151 (fromBus, fromPC);
  \74273  inst39 (
    .D2(inst36_o15), .D3(inst36_o14), .D1(inst36_o16), .D4(inst36_o13), .D7(inst36_o10), .D6(inst36_o11),
    .D5(inst36_o12), .D8(inst36_o9), .CLK(inst66_out), .Q4(inst39_q4), .Q1(inst39_q1), .Q2(inst39_q2),
    .Q3(inst39_q3), .Q6(inst39_q6), .Q5(inst39_q5));  // open: CLRN, Q7, Q8
  \74273  IR (
    .D2(inst36_o7), .D3(inst36_o6), .D1(inst36_o8), .D4(inst36_o5), .D7(inst36_o2), .D6(inst36_o3),
    .D5(inst36_o4), .D8(inst36_o1), .CLK(inst66_out), .Q1(IR_q1), .Q2(IR_q2), .Q3(IR_q3), .Q6(IR_q6),
    .Q7(IR_q7), .Q8(IR_q8));  // open: CLRN, Q4, Q5
  not inst5 (inst5_out, 1'b0);
  \74161  inst2 (
    .CLRN(inst87_q2), .CLK(inst600_out), .ENP(inst1_rco), .LDN(inst40_out), .A(inst36_o5), .D(inst36_o8),
    .ENT(inst1_rco), .B(inst36_o6), .C(inst36_o7), .QD(inst2_qd), .QC(inst2_qc), .QB(inst2_qb), .QA(inst2_qa));  // open: RCO
  \74161  inst1 (
    .CLRN(inst87_q2), .CLK(inst600_out), .ENP(inst5_out), .LDN(inst40_out), .A(inst36_o1), .D(inst36_o4),
    .ENT(inst5_out), .B(inst36_o2), .C(inst36_o3), .QD(inst1_qd), .QC(inst1_qc), .QB(inst1_qb),
    .QA(inst1_qa), .RCO(inst1_rco));
  or inst37 (inst37_out, oALU, oMDR);
  \8choser  inst150 (
    .Achose(fromBus), .A8(inst36_o8), .A7(inst36_o7), .A6(inst36_o6), .A5(inst36_o5), .A4(inst36_o4),
    .A3(inst36_o3), .A2(inst36_o2), .A1(inst36_o1), .B8(inst2_qd), .B7(inst2_qc), .B6(inst2_qb),
    .B5(inst2_qa), .B4(inst1_qd), .B3(inst1_qc), .B2(inst1_qb), .B1(inst1_qa), .Bchose(fromPC),
    .o8(inst150_o8), .o7(inst150_o7), .o6(inst150_o6), .o5(inst150_o5), .o4(inst150_o4), .o3(inst150_o3),
    .o2(inst150_o2), .o1(inst150_o1));
  \16choser  inst36 (
    .Achose(inst37_out), .A16(inst29_o16), .A15(inst29_o15), .A14(inst29_o14), .A13(inst29_o13),
    .A12(inst29_o12), .A11(inst29_o11), .A10(inst29_o10), .A9(inst29_o9), .B16(inst26_o16), .B15(inst26_o15),
    .B14(inst26_o14), .B13(inst26_o13), .B12(inst26_o12), .B11(inst26_o11), .B10(inst26_o10), .B9(inst26_o9),
    .A8(inst29_o8), .A7(inst29_o7), .A6(inst29_o6), .A5(inst29_o5), .A4(inst29_o4), .A3(inst29_o3),
    .A2(inst29_o2), .A1(inst29_o1), .B8(inst26_o8), .B7(inst26_o7), .B6(inst26_o6), .B5(inst26_o5),
    .B4(inst26_o4), .B3(inst26_o3), .B2(inst26_o2), .B1(inst26_o1), .Bchose(inst38_out), .o16(inst36_o16),
    .o15(inst36_o15), .o14(inst36_o14), .o13(inst36_o13), .o12(inst36_o12), .o11(inst36_o11),
    .o10(inst36_o10), .o9(inst36_o9), .o8(inst36_o8), .o7(inst36_o7), .o6(inst36_o6), .o5(inst36_o5),
    .o4(inst36_o4), .o3(inst36_o3), .o2(inst36_o2), .o1(inst36_o1));
  \74273  MAR (
    .D2(inst150_o7), .D3(inst150_o6), .D1(inst150_o8), .D4(inst150_o5), .D7(inst150_o2), .D6(inst150_o3),
    .D5(inst150_o4), .D8(inst150_o1), .CLK(inst620_out), .Q4(ad[4]), .Q1(ad[7]), .Q2(ad[6]), .Q3(ad[5]),
    .Q6(ad[2]), .Q5(ad[3]), .Q7(ad[1]), .Q8(ad[0]));  // open: CLRN
  \16choser  inst10 (
    .Achose(inst84_y21n), .A16(q[15]), .A15(q[14]), .A14(q[13]), .A13(q[12]), .A12(q[11]), .A11(q[10]),
    .A10(q[9]), .A9(q[8]), .B16(inst36_o16), .B15(inst36_o15), .B14(inst36_o14), .B13(inst36_o13),
    .B12(inst36_o12), .B11(inst36_o11), .B10(inst36_o10), .B9(inst36_o9), .A8(q[7]), .A7(q[6]), .A6(q[5]),
    .A5(q[4]), .A4(q[3]), .A3(q[2]), .A2(q[1]), .A1(q[0]), .B8(inst36_o8), .B7(inst36_o7), .B6(inst36_o6),
    .B5(inst36_o5), .B4(inst36_o4), .B3(inst36_o3), .B2(inst36_o2), .B1(inst36_o1), .Bchose(inst84_y22n),
    .o16(inst10_o16), .o15(inst10_o15), .o14(inst10_o14), .o13(inst10_o13), .o12(inst10_o12),
    .o11(inst10_o11), .o10(inst10_o10), .o9(inst10_o9), .o8(inst10_o8), .o7(inst10_o7), .o6(inst10_o6),
    .o5(inst10_o5), .o4(inst10_o4), .o3(inst10_o3), .o2(inst10_o2), .o1(inst10_o1));
  \16choser  inst29 (
    .Achose(oALU), .A16(inst9_o16), .A15(inst9_o15), .A14(inst9_o14), .A13(inst9_o13), .A12(inst9_o12),
    .A11(inst9_o11), .A10(inst9_o10), .A9(inst9_o9), .B16(dd[15]), .B15(dd[14]), .B14(dd[13]), .B13(dd[12]),
    .B12(dd[11]), .B11(dd[10]), .B10(dd[9]), .B9(dd[8]), .A8(inst9_o8), .A7(inst9_o7), .A6(inst9_o6),
    .A5(inst9_o5), .A4(inst9_o4), .A3(inst9_o3), .A2(inst9_o2), .A1(inst9_o1), .B8(dd[7]), .B7(dd[6]),
    .B6(dd[5]), .B5(dd[4]), .B4(dd[3]), .B3(dd[2]), .B2(dd[1]), .B1(dd[0]), .Bchose(oMDR), .o16(inst29_o16),
    .o15(inst29_o15), .o14(inst29_o14), .o13(inst29_o13), .o12(inst29_o12), .o11(inst29_o11),
    .o10(inst29_o10), .o9(inst29_o9), .o8(inst29_o8), .o7(inst29_o7), .o6(inst29_o6), .o5(inst29_o5),
    .o4(inst29_o4), .o3(inst29_o3), .o2(inst29_o2), .o1(inst29_o1));
  \74273  MDR (
    .D2(inst10_o15), .D3(inst10_o14), .D1(inst10_o16), .D4(inst10_o13), .D7(inst10_o10), .D6(inst10_o11),
    .D5(inst10_o12), .D8(inst10_o9), .CLK(inst51_out), .Q4(dd[12]), .Q1(dd[15]), .Q2(dd[14]), .Q3(dd[13]),
    .Q6(dd[10]), .Q5(dd[11]), .Q7(dd[9]), .Q8(dd[8]));  // open: CLRN
  \74273  inst7 (
    .D2(inst10_o7), .D3(inst10_o6), .D1(inst10_o8), .D4(inst10_o5), .D7(inst10_o2), .D6(inst10_o3),
    .D5(inst10_o4), .D8(inst10_o1), .CLK(inst51_out), .Q4(dd[4]), .Q1(dd[7]), .Q2(dd[6]), .Q3(dd[5]),
    .Q6(dd[2]), .Q5(dd[3]), .Q7(dd[1]), .Q8(dd[0]));  // open: CLRN
  RAM inst3 (.data(dd), .wren(inst86_q8), .address(ad), .q(q));  // open: clock
  or inst38 (inst38_out, inst35_out, inst34_out);
  \16choser  inst26 (
    .Achose(inst35_out), .A16(inst27_o16), .A15(inst27_o15), .A14(inst27_o14), .A13(inst27_o13),
    .A12(inst27_o12), .A11(inst27_o11), .A10(inst27_o10), .A9(inst27_o9), .B16(inst28_o16), .B15(inst28_o15),
    .B14(inst28_o14), .B13(inst28_o13), .B12(inst28_o12), .B11(inst28_o11), .B10(inst28_o10), .B9(inst28_o9),
    .A8(inst27_o8), .A7(inst27_o7), .A6(inst27_o6), .A5(inst27_o5), .A4(inst27_o4), .A3(inst27_o3),
    .A2(inst27_o2), .A1(inst27_o1), .B8(inst28_o8), .B7(inst28_o7), .B6(inst28_o6), .B5(inst28_o5),
    .B4(inst28_o4), .B3(inst28_o3), .B2(inst28_o2), .B1(inst28_o1), .Bchose(inst34_out), .o16(inst26_o16),
    .o15(inst26_o15), .o14(inst26_o14), .o13(inst26_o13), .o12(inst26_o12), .o11(inst26_o11),
    .o10(inst26_o10), .o9(inst26_o9), .o8(inst26_o8), .o7(inst26_o7), .o6(inst26_o6), .o5(inst26_o5),
    .o4(inst26_o4), .o3(inst26_o3), .o2(inst26_o2), .o1(inst26_o1));
  \74273  R1_1 (
    .D2(inst36_o15), .D3(inst36_o14), .D1(inst36_o16), .D4(inst36_o13), .D7(inst36_o10), .D6(inst36_o11),
    .D5(inst36_o12), .D8(inst36_o9), .CLK(inst143_out), .Q4(R1_1_q4), .Q1(R1_1_q1), .Q2(R1_1_q2),
    .Q3(R1_1_q3), .Q6(R1_1_q6), .Q5(R1_1_q5), .Q7(R1_1_q7), .Q8(R1_1_q8));  // open: CLRN
  \74273  R1 (
    .D2(inst36_o7), .D3(inst36_o6), .D1(inst36_o8), .D4(inst36_o5), .D7(inst36_o2), .D6(inst36_o3),
    .D5(inst36_o4), .D8(inst36_o1), .CLK(inst143_out), .Q4(R1_q4), .Q1(R1_q1), .Q2(R1_q2), .Q3(R1_q3),
    .Q6(R1_q6), .Q5(R1_q5), .Q7(R1_q7), .Q8(R1_q8));  // open: CLRN
  \74273  R2_2 (
    .D2(inst36_o15), .D3(inst36_o14), .D1(inst36_o16), .D4(inst36_o13), .D7(inst36_o10), .D6(inst36_o11),
    .D5(inst36_o12), .D8(inst36_o9), .CLK(inst460_out), .Q4(R2_2_q4), .Q1(R2_2_q1), .Q2(R2_2_q2),
    .Q3(R2_2_q3), .Q6(R2_2_q6), .Q5(R2_2_q5), .Q7(R2_2_q7), .Q8(R2_2_q8));  // open: CLRN
  \74273  R2 (
    .D2(inst36_o7), .D3(inst36_o6), .D1(inst36_o8), .D4(inst36_o5), .D7(inst36_o2), .D6(inst36_o3),
    .D5(inst36_o4), .D8(inst36_o1), .CLK(inst460_out), .Q4(R2_q4), .Q1(R2_q1), .Q2(R2_q2), .Q3(R2_q3),
    .Q6(R2_q6), .Q5(R2_q5), .Q7(R2_q7), .Q8(R2_q8));  // open: CLRN
  or inst34 (inst34_out, oR5, oR4);
  \74273  inst30 (
    .D2(inst36_o15), .D3(inst36_o14), .D1(inst36_o16), .D4(inst36_o13), .D7(inst36_o10), .D6(inst36_o11),
    .D5(inst36_o12), .D8(inst36_o9), .CLK(inst49_out), .Q4(inst30_q4), .Q1(inst30_q1), .Q2(inst30_q2),
    .Q3(inst30_q3), .Q6(inst30_q6), .Q5(inst30_q5), .Q7(inst30_q7), .Q8(inst30_q8));  // open: CLRN
  \74273  inst31 (
    .D2(inst36_o7), .D3(inst36_o6), .D1(inst36_o8), .D4(inst36_o5), .D7(inst36_o2), .D6(inst36_o3),
    .D5(inst36_o4), .D8(inst36_o1), .CLK(inst49_out), .Q4(inst31_q4), .Q1(inst31_q1), .Q2(inst31_q2),
    .Q3(inst31_q3), .Q6(inst31_q6), .Q5(inst31_q5), .Q7(inst31_q7), .Q8(inst31_q8));  // open: CLRN
  mutiplyer2 inst6 (
    .B8(R1_q1), .B7(R1_q2), .B6(R1_q3), .B5(R1_q4), .B4(R1_q5), .B3(R1_q6), .B2(R1_q7), .B1(R1_q8),
    .A8(R2_q1), .A7(R2_q2), .A6(R2_q3), .A5(R2_q4), .A4(R2_q5), .A3(R2_q6), .A2(R2_q7), .A1(R2_q8),
    .f16(inst6_f16), .f15(inst6_f15), .f14(inst6_f14), .f13(inst6_f13), .f12(inst6_f12), .f11(inst6_f11),
    .f10(inst6_f10), .f9(inst6_f9), .f8(inst6_f8), .f7(inst6_f7), .f6(inst6_f6), .f5(inst6_f5),
    .f4(inst6_f4), .f3(inst6_f3), .f2(inst6_f2), .f1(inst6_f1));  // open: clock99, cleana
  \16ALU  inst (
    .A16(R1_1_q1), .A15(R1_1_q2), .A14(R1_1_q3), .A13(R1_1_q4), .A12(R1_1_q5), .A11(R1_1_q6), .A10(R1_1_q7),
    .A9(R1_1_q8), .A8(R1_q1), .A7(R1_q2), .A6(R1_q3), .A5(R1_q4), .A4(R1_q5), .A3(R1_q6), .A2(R1_q7),
    .LM(inst88_q1), .A1(R1_q8), .DM(inst88_q2), .RM(inst88_q3), .CPR0(inst63_out), .B16(R2_2_q1),
    .B15(R2_2_q2), .B14(R2_2_q3), .B13(R2_2_q4), .B12(R2_2_q5), .B11(R2_2_q6), .B10(R2_2_q7), .B9(R2_2_q8),
    .CPR2(inst64_out), .B8(R2_q1), .B7(R2_q2), .B6(R2_q3), .B5(R2_q4), .B4(R2_q5), .B3(R2_q6), .B2(R2_q7),
    .B1(R2_q8), .CPR1(inst65_out), .CN(inst85_q6), .M(inst85_q1), .S0(inst85_q5), .S1(inst85_q4),
    .S2(inst85_q3), .S3(inst85_q2), .f16(inst_f16), .f15(inst_f15), .f14(inst_f14), .f13(inst_f13),
    .f12(inst_f12), .f11(inst_f11), .f10(inst_f10), .f9(inst_f9), .f8(inst_f8), .f7(inst_f7), .f6(inst_f6),
    .f5(inst_f5), .f4(inst_f4), .f3(inst_f3), .f2(inst_f2), .f1(inst_f1));
  \16choser  inst28 (
    .Achose(oR5), .A16(inst30_q1), .A15(inst30_q2), .A14(inst30_q3), .A13(inst30_q4), .A12(inst30_q5),
    .A11(inst30_q6), .A10(inst30_q7), .A9(inst30_q8), .B16(inst32_q1), .B15(inst32_q2), .B14(inst32_q3),
    .B13(inst32_q4), .B12(inst32_q5), .B11(inst32_q6), .B10(inst32_q7), .B9(inst32_q8), .A8(inst31_q1),
    .A7(inst31_q2), .A6(inst31_q3), .A5(inst31_q4), .A4(inst31_q5), .A3(inst31_q6), .A2(inst31_q7),
    .A1(inst31_q8), .B8(inst33_q1), .B7(inst33_q2), .B6(inst33_q3), .B5(inst33_q4), .B4(inst33_q5),
    .B3(inst33_q6), .B2(inst33_q7), .B1(inst33_q8), .Bchose(oR4), .o16(inst28_o16), .o15(inst28_o15),
    .o14(inst28_o14), .o13(inst28_o13), .o12(inst28_o12), .o11(inst28_o11), .o10(inst28_o10), .o9(inst28_o9),
    .o8(inst28_o8), .o7(inst28_o7), .o6(inst28_o6), .o5(inst28_o5), .o4(inst28_o4), .o3(inst28_o3),
    .o2(inst28_o2), .o1(inst28_o1));
  \16choser  inst9 (
    .Achose(inst75_out), .A16(inst6_f16), .A15(inst6_f15), .A14(inst6_f14), .A13(inst6_f13), .A12(inst6_f12),
    .A11(inst6_f11), .A10(inst6_f10), .A9(inst6_f9), .B16(inst_f16), .B15(inst_f15), .B14(inst_f14),
    .B13(inst_f13), .B12(inst_f12), .B11(inst_f11), .B10(inst_f10), .B9(inst_f9), .A8(inst6_f8),
    .A7(inst6_f7), .A6(inst6_f6), .A5(inst6_f5), .A4(inst6_f4), .A3(inst6_f3), .A2(inst6_f2), .A1(inst6_f1),
    .B8(inst_f8), .B7(inst_f7), .B6(inst_f6), .B5(inst_f5), .B4(inst_f4), .B3(inst_f3), .B2(inst_f2),
    .B1(inst_f1), .Bchose(inst76_out), .o16(inst9_o16), .o15(inst9_o15), .o14(inst9_o14), .o13(inst9_o13),
    .o12(inst9_o12), .o11(inst9_o11), .o10(inst9_o10), .o9(inst9_o9), .o8(inst9_o8), .o7(inst9_o7),
    .o6(inst9_o6), .o5(inst9_o5), .o4(inst9_o4), .o3(inst9_o3), .o2(inst9_o2), .o1(inst9_o1));
  \74273  inst14 (
    .D2(inst36_o15), .D3(inst36_o14), .D1(inst36_o16), .D4(inst36_o13), .D7(inst36_o10), .D6(inst36_o11),
    .D5(inst36_o12), .D8(inst36_o9), .CLK(inst47_out), .Q4(inst14_q4), .Q1(inst14_q1), .Q2(inst14_q2),
    .Q3(inst14_q3), .Q6(inst14_q6), .Q5(inst14_q5), .Q7(inst14_q7), .Q8(inst14_q8));  // open: CLRN
  \74273  R3 (
    .D2(inst36_o7), .D3(inst36_o6), .D1(inst36_o8), .D4(inst36_o5), .D7(inst36_o2), .D6(inst36_o3),
    .D5(inst36_o4), .D8(inst36_o1), .CLK(inst47_out), .Q4(R3_q4), .Q1(R3_q1), .Q2(R3_q2), .Q3(R3_q3),
    .Q6(R3_q6), .Q5(R3_q5), .Q7(R3_q7), .Q8(R3_q8));  // open: CLRN
  \74273  inst23 (
    .D2(inst36_o15), .D3(inst36_o14), .D1(inst36_o16), .D4(inst36_o13), .D7(inst36_o10), .D6(inst36_o11),
    .D5(inst36_o12), .D8(inst36_o9), .CLK(inst480_out), .Q4(inst23_q4), .Q1(inst23_q1), .Q2(inst23_q2),
    .Q3(inst23_q3), .Q6(inst23_q6), .Q5(inst23_q5), .Q7(inst23_q7), .Q8(inst23_q8));  // open: CLRN
  \74273  R4 (
    .D2(inst36_o7), .D3(inst36_o6), .D1(inst36_o8), .D4(inst36_o5), .D7(inst36_o2), .D6(inst36_o3),
    .D5(inst36_o4), .D8(inst36_o1), .CLK(inst480_out), .Q4(R4_q4), .Q1(R4_q1), .Q2(R4_q2), .Q3(R4_q3),
    .Q6(R4_q6), .Q5(R4_q5), .Q7(R4_q7), .Q8(R4_q8));  // open: CLRN
  \74273  inst32 (
    .D2(inst36_o15), .D3(inst36_o14), .D1(inst36_o16), .D4(inst36_o13), .D7(inst36_o10), .D6(inst36_o11),
    .D5(inst36_o12), .D8(inst36_o9), .CLK(inst50_out), .Q4(inst32_q4), .Q1(inst32_q1), .Q2(inst32_q2),
    .Q3(inst32_q3), .Q6(inst32_q6), .Q5(inst32_q5), .Q7(inst32_q7), .Q8(inst32_q8));  // open: CLRN
  \74273  inst33 (
    .D2(inst36_o7), .D3(inst36_o6), .D1(inst36_o8), .D4(inst36_o5), .D7(inst36_o2), .D6(inst36_o3),
    .D5(inst36_o4), .D8(inst36_o1), .CLK(inst50_out), .Q4(inst33_q4), .Q1(inst33_q1), .Q2(inst33_q2),
    .Q3(inst33_q3), .Q6(inst33_q6), .Q5(inst33_q5), .Q7(inst33_q7), .Q8(inst33_q8));  // open: CLRN
  or inst35 (inst35_out, inst133_out, oR3);
  not inst22 (inst22_out, 1'b0);
  \7485  inst17 (
    .A3(inst14_q1), .B2(inst23_q2), .A2(inst14_q2), .AEBI(inst18_aebo), .AGBI(inst18_agbo),
    .ALBI(inst18_albo), .A0(inst14_q4), .B0(inst23_q4), .B3(inst23_q1), .A1(inst14_q3), .B1(inst23_q3),
    .ALBO(inst17_albo), .AGBO(inst17_agbo), .AEBO(inst17_aebo));
  \7485  inst18 (
    .A3(inst14_q5), .B2(inst23_q6), .A2(inst14_q6), .AEBI(inst19_aebo), .AGBI(inst19_agbo),
    .ALBI(inst19_albo), .A0(inst14_q8), .B0(inst23_q8), .B3(inst23_q5), .A1(inst14_q7), .B1(inst23_q7),
    .ALBO(inst18_albo), .AGBO(inst18_agbo), .AEBO(inst18_aebo));
  \7485  inst19 (
    .A3(R3_q1), .B2(R4_q2), .A2(R3_q2), .AEBI(inst20_aebo), .AGBI(inst20_agbo), .ALBI(inst20_albo),
    .A0(R3_q4), .B0(R4_q4), .B3(R4_q1), .A1(R3_q3), .B1(R4_q3), .ALBO(inst19_albo), .AGBO(inst19_agbo),
    .AEBO(inst19_aebo));
  \7485  inst20 (
    .A3(R3_q5), .B2(R4_q6), .A2(R3_q6), .AEBI(inst22_out), .AGBI(1'b0), .ALBI(1'b0), .A0(R3_q8), .B0(R4_q8),
    .B3(R4_q5), .A1(R3_q7), .B1(R4_q7), .ALBO(inst20_albo), .AGBO(inst20_agbo), .AEBO(inst20_aebo));
  \74273  inst11 (
    .D7(inst17_aebo), .D6(inst17_albo), .D8(inst17_agbo), .CLK(inst61_out), .Q6(inst11_q6), .Q7(inst11_q7),
    .Q8(inst11_q8));  // open: D2, D3, D1, D4, D5, CLRN, Q4, Q1, Q2, Q3, Q5
  and inst8 (inst8_out, inst11_q8, inst84_y11n);
  and inst12 (inst12_out, inst11_q7, inst84_y12n);
  and inst16 (inst16_out, inst11_q6, inst84_y13n);
  \16choser  inst27 (
    .Achose(inst133_out), .A16(inst23_q1), .A15(inst23_q2), .A14(inst23_q3), .A13(inst23_q4),
    .A12(inst23_q5), .A11(inst23_q6), .A10(inst23_q7), .A9(inst23_q8), .B16(inst14_q1), .B15(inst14_q2),
    .B14(inst14_q3), .B13(inst14_q4), .B12(inst14_q5), .B11(inst14_q6), .B10(inst14_q7), .B9(inst14_q8),
    .A8(R4_q1), .A7(R4_q2), .A6(R4_q3), .A5(R4_q4), .A4(R4_q5), .A3(R4_q6), .A2(R4_q7), .A1(R4_q8),
    .B8(R3_q1), .B7(R3_q2), .B6(R3_q3), .B5(R3_q4), .B4(R3_q5), .B3(R3_q6), .B2(R3_q7), .B1(R3_q8),
    .Bchose(oR3), .o16(inst27_o16), .o15(inst27_o15), .o14(inst27_o14), .o13(inst27_o13), .o12(inst27_o12),
    .o11(inst27_o11), .o10(inst27_o10), .o9(inst27_o9), .o8(inst27_o8), .o7(inst27_o7), .o6(inst27_o6),
    .o5(inst27_o5), .o4(inst27_o4), .o3(inst27_o3), .o2(inst27_o2), .o1(inst27_o1));
  or inst24 (inst24_out, inst8_out, inst12_out, inst16_out);
  not inst40 (inst40_out, inst24_out);
endmodule
